# EAGLE design HuUSB_rev_B (EAGLE 9.6.2)
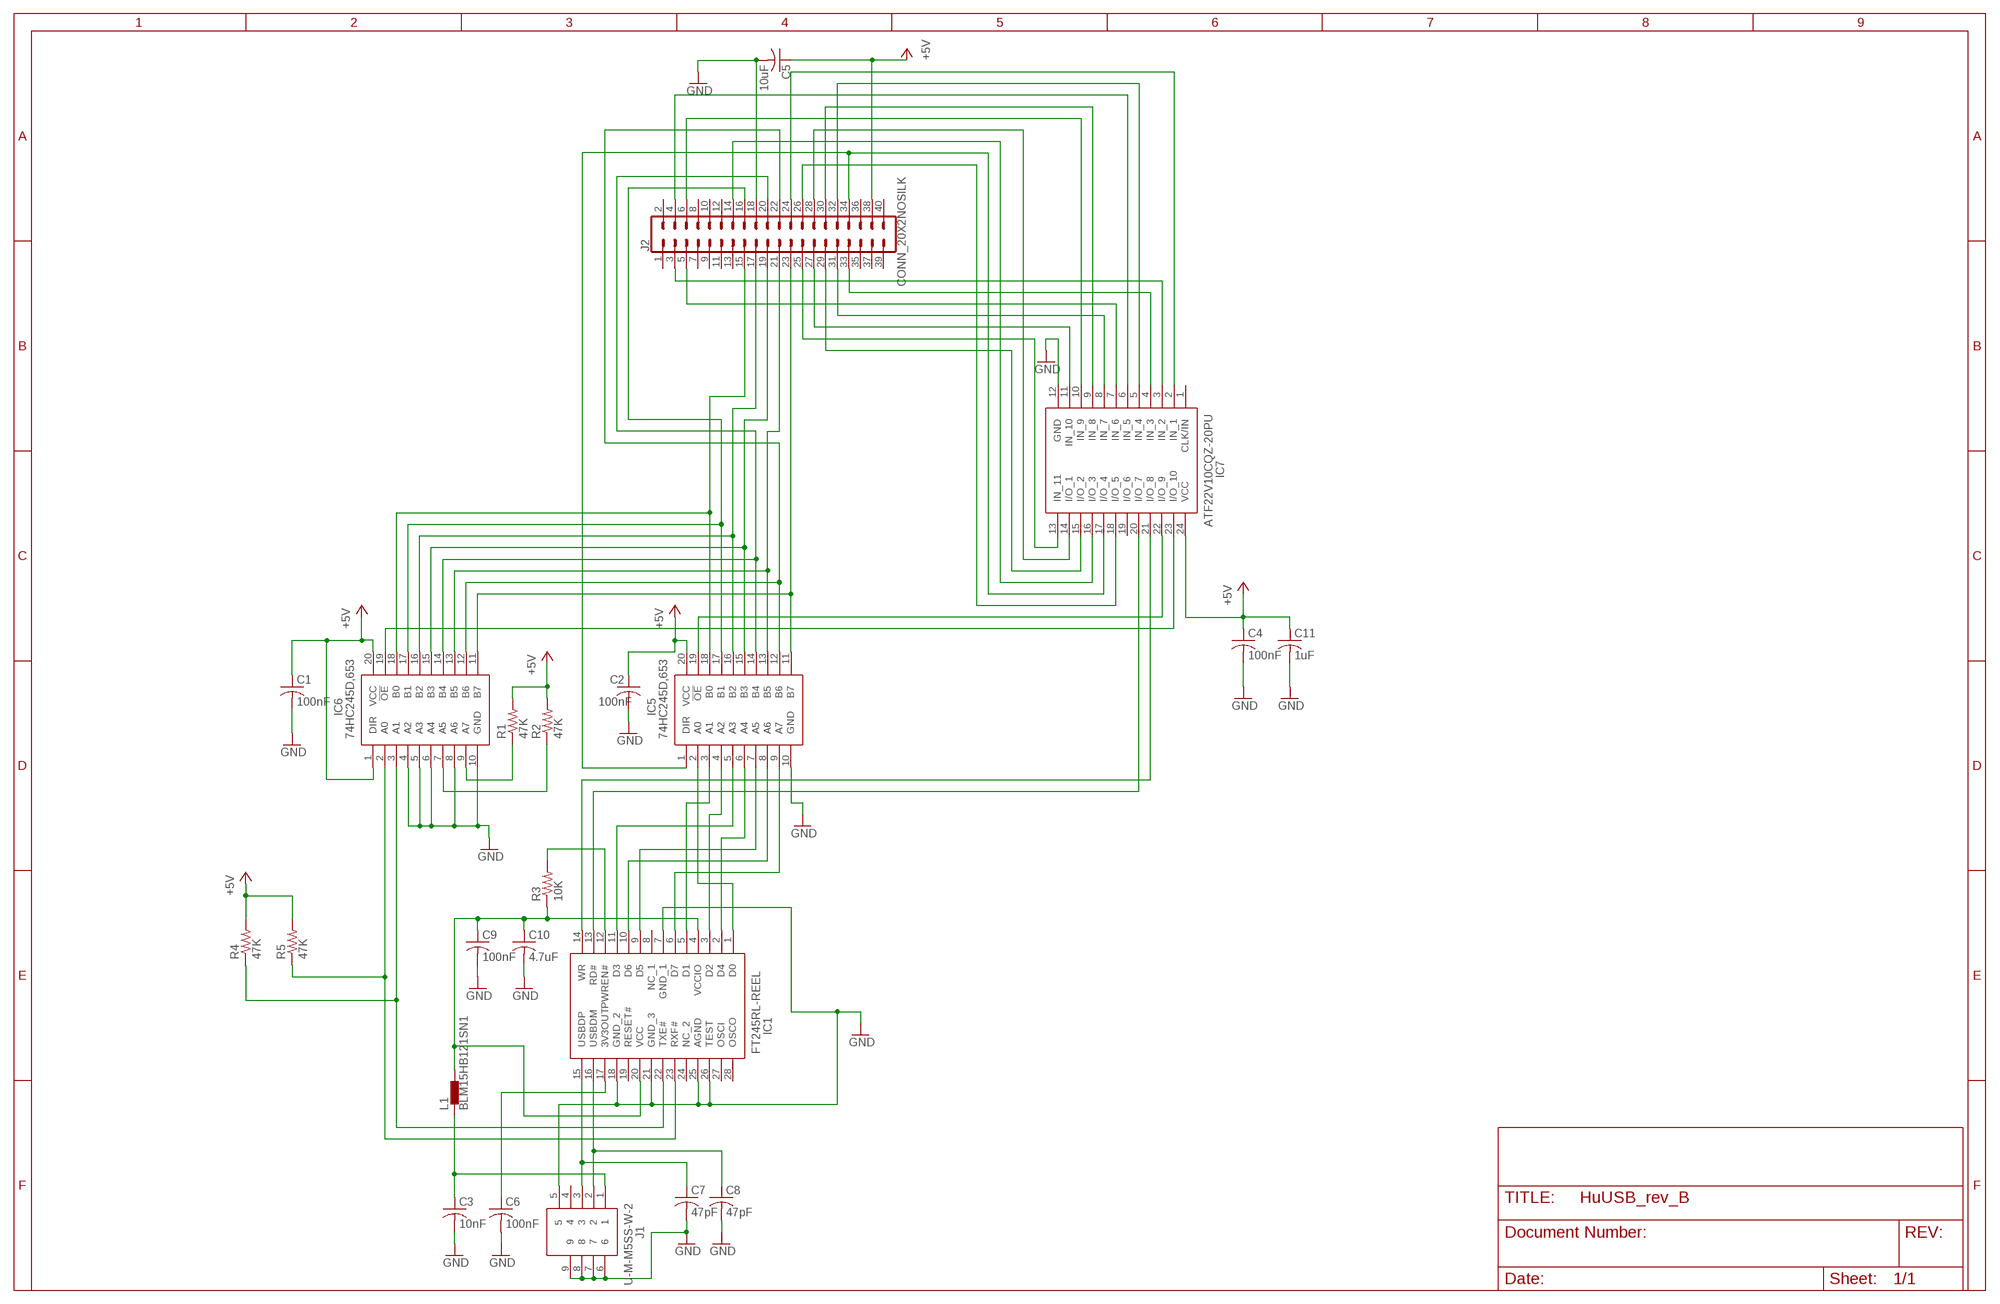
[diagram p0: schematic, sheet 1]

## Parts
C1  100nF  C-USC0603  [C0603]
C2  100nF  C-USC0603  [C0603]
C3  10nF  C-USC0603  [C0603]
C4  100nF  C-USC0603  [C0603]
C5  10uF  C-USC0805  [C0805]
C6  100nF  C-USC0603  [C0603]
C7  47pF  C-USC0603  [C0603]
C8  47pF  C-USC0603  [C0603]
C9  100nF  C-USC0603  [C0603]
C10  4.7uF  C-USC0603  [C0603]
C11  1uF  C-USC0603  [C0603]
IC1  FT245RL-REEL  [SOP65P778X200-28N]
IC5  74HC245D,653  [SOIC127P1032X265-20N]
IC6  74HC245D,653  [SOIC127P1032X265-20N]
IC7  ATF22V10CQZ-20PU  [DIP794W56P254L3188H533Q24N]
J1  U-M-M5SS-W-2  [U-M-M5SS-W-2]
J2  CONN_20X2NOSILK  [2X20_NOSILK]
L1  BLM15HB121SN1  [0402]
R1  47K  R-US_R0603  [R0603]
R2  47K  R-US_R0603  [R0603]
R3  10K  R-US_R0603  [R0603]
R4  47K  R-US_R0603  [R0603]
R5  47K  R-US_R0603  [R0603]

## Nets
+5V: C1.1 C2.1 C4.1 C5.1 C11.1 IC5.20(VCC) IC6.1(DIR) IC6.20(VCC) IC7.24(VCC) J2.38 R1.2 R2.2 R4.2 R5.2
GND: C1.2 C2.2 C3.2 C4.2 C5.2 C6.2 C7.2 C8.2 C9.2 C10.2 C11.2 IC1.7(GND_1) IC1.18(GND_2) IC1.21(GND_3) IC1.25(AGND) IC1.26(TEST) IC5.10(GND) IC6.4(A2) IC6.5(A3) IC6.6(A4) IC6.8(A6) IC6.10(GND) IC7.12(GND) J1.5 J1.6 J1.7 J1.8 J1.9 J2.18
N$1: IC7.2(IN_1) J2.24
N$2: IC7.3(IN_2) J2.3
N$3: IC7.4(IN_3) J2.33
N$4: IC7.5(IN_4) J2.32
N$5: IC7.6(IN_5) J2.4
N$6: IC7.7(IN_6) J2.5
N$7: IC7.8(IN_7) J2.31
N$8: IC7.9(IN_8) J2.30
N$9: IC7.10(IN_9) J2.6
N$10: IC7.11(IN_10) J2.27
N$11: IC7.13(IN_11) J2.25
N$12: IC7.14(I/O_1) J2.28
N$13: IC7.15(I/O_2) J2.29
N$14: IC7.16(I/O_3) J2.14
N$15: IC5.1(DIR) IC7.17(I/O_4) J2.34
N$16: IC7.18(I/O_5) J2.26
N$17: IC1.14(WR) IC7.21(I/O_8)
N$18: IC1.1(D0) IC5.2(A0)
N$19: IC6.9(A7) R1.1
N$20: IC1.2(D4) IC5.6(A4)
N$21: IC1.11(D3) IC5.5(A3)
N$22: IC1.5(D1) IC5.3(A1)
N$23: IC1.9(D5) IC5.7(A5)
N$24: IC1.10(D6) IC5.8(A6)
N$25: IC1.6(D7) IC5.9(A7)
N$26: IC6.19(!OE) IC7.23(I/O_10)
N$27: IC5.19(!OE) IC7.22(I/O_9)
N$28: IC5.18(B0) IC6.18(B0) J2.15
N$29: IC1.13(RD#) IC7.20(I/O_7)
N$30: IC5.17(B1) IC6.17(B1) J2.16
N$31: IC5.16(B2) IC6.16(B2) J2.17
N$32: IC5.15(B3) IC6.15(B3) J2.19
N$33: IC5.14(B4) IC6.14(B4) J2.20
N$34: IC5.13(B5) IC6.13(B5) J2.21
N$35: IC5.12(B6) IC6.12(B6) J2.22
N$36: IC5.11(B7) IC6.11(B7) J2.23
N$37: IC1.3(D2) IC5.4(A2)
N$38: C6.1 IC1.17(3V3OUT)
N$39: IC6.7(A5) R2.1
N$40: C7.1 IC1.15(USBDP) J1.3
N$41: C8.1 IC1.16(USBDM) J1.2
N$42: C9.1 C10.1 IC1.4(VCCIO) IC1.20(VCC) L1.2 R3.1
N$43: IC1.12(PWREN#) R3.2
N$44: C3.1 J1.1 L1.1
N$45: IC1.22(TXE#) IC6.3(A1) R4.1
N$46: IC1.23(RXF#) IC6.2(A0) R5.1
Unconnected: IC1.8(NC_1) IC1.19(RESET#) IC1.24(NC_2) IC1.27(OSCI) IC1.28(OSCO) IC7.1(CLK/IN) IC7.19(I/O_6) J1.4 J2.1 J2.2 J2.7 J2.8 J2.9 J2.10 J2.11 J2.12 J2.13 J2.35 J2.36 J2.37 J2.39 J2.40

## Library data of the parts
C1-C11 = resistor:C-US: CAPACITOR, American symbol
IC1 = PC-Engine:FT245RL-REEL: FTDI Chip FT245RL-REEL, USB Controller, 1Mbps, USB 2.0, 1.8 5.25 V, 28-Pin SSOP Source: Datasheet <https://www.ftdichip.com/Support/Documents/DataSheets/ICs/DS_FT245R.pdf>; ARROW_PART_NUMBER: FT245RL-REEL; ARROW_PRICE-STOCK: https://www.arrow.com/en/products/ft245rl-reel/ftdi-chip; DESCRIPTION: FTDI Chip FT245RL-REEL, USB Controller, 1Mbps, USB 2.0, 1.8 5.25 V, 28-Pin SSOP; HEIGHT: 2mm; MANUFACTURER_NAME: FTDI Chip; MANUFACTURER_PART_NUMBER: FT245RL-REEL; MOUSER_PART_NUMBER: 895-FT245RL; MOUSER_PRICE-STOCK: https://www.mouser.co.uk/ProductDetail/FTDI/FT245RL-REEL?qs=D1%2FPMqvA1020O4Xjb5coqA%3D%3D
IC5 IC6 = PC-Engine:74HC245D,653: 74HC(T)245 - Octal bus transceiver; 3-state@en-us Source: Datasheet <https://assets.nexperia.com/documents/data-sheet/74HC_HCT245.pdf>; ARROW_PART_NUMBER: 74HC245D,653; ARROW_PRICE-STOCK: https://www.arrow.com/en/products/74hc245d653/nexperia; DESCRIPTION: 74HC(T)245 - Octal bus transceiver; 3-state@en-us; HEIGHT: 2.65mm; MANUFACTURER_NAME: Nexperia; MANUFACTURER_PART_NUMBER: 74HC245D,653; MOUSER_PART_NUMBER: 771-74HC245D-T; MOUSER_PRICE-STOCK: https://www.mouser.co.uk/ProductDetail/Nexperia/74HC245D653/?qs=P62ublwmbi8JbvNhK4vCnA%3D%3D
IC7 = PC-Engine:ATF22V10CQZ-20PU: SPLD 500 Gates 10 Macro Cells 50MHz 5V ATF22V10CQZ-20PU, SPLD PAL 500 Gates, 10 Macro Cells, 10 I/O, 45.5MHz 20ns EECMOS 4.5 5.5 V 24-Pin PDIP Source: Datasheet <http://uk.rs-online.com/web/p/products/7380319>; ARROW_PART_NUMBER: ATF22V10CQZ-20PU; ARROW_PRICE-STOCK: https://www.arrow.com/en/products/atf22v10cqz-20pu/microchip-technology; DESCRIPTION: SPLD 500 Gates 10 Macro Cells 50MHz 5V ATF22V10CQZ-20PU, SPLD PAL 500 Gates, 10 Macro Cells, 10 I/O, 45.5MHz 20ns EECMOS 4.5 5.5 V 24-Pin PDIP; HEIGHT: 5.334mm; MANUFACTURER_NAME: Microchip; MANUFACTURER_PART_NUMBER: ATF22V10CQZ-20PU; MOUSER_PART_NUMBER: 556-AF22V10CQZ-20PU; MOUSER_PRICE-STOCK: https://www.mouser.co.uk/ProductDetail/Microchip-Technology-Atmel/ATF22V10CQZ-20PU/?qs=2mdvTlUeTfCbTTksYbflfg%3D%3D
J1 = PC-Engine:U-M-M5SS-W-2
J2 = SparkFun-Connectors:CONN_20X2: Multi connection point. Often used as Generic Header-pin footprint for 0.1 inch spaced/style header connections On any of the 0.1 inch spaced packages, you can populate with these: Break Away Headers - Straight <https://www.sparkfun.com/products/116> (PRT-00116) Break Away Male Headers - Right Angle <https://www.sparkfun.com/products/553> (PRT-00553) Female Headers <https://www.sparkfun.com/products/115> (PRT-00115) Break Away Headers - Machine Pin <https://www.sparkfun.com/products/117> (PRT-00117) Break Away Female Headers - Swiss Machine Pin <https://www.sparkfun.com/products/743> (PRT-00743)
L1 = inductors:BLM15H: EMIFIL (R) Chip Ferrite Bead for GHz Noise Source: http://www.murata.com/ Ferrite Bead BLM15H.pdf
R1-R5 = resistor:R-US_: RESISTOR, American symbol

## Board
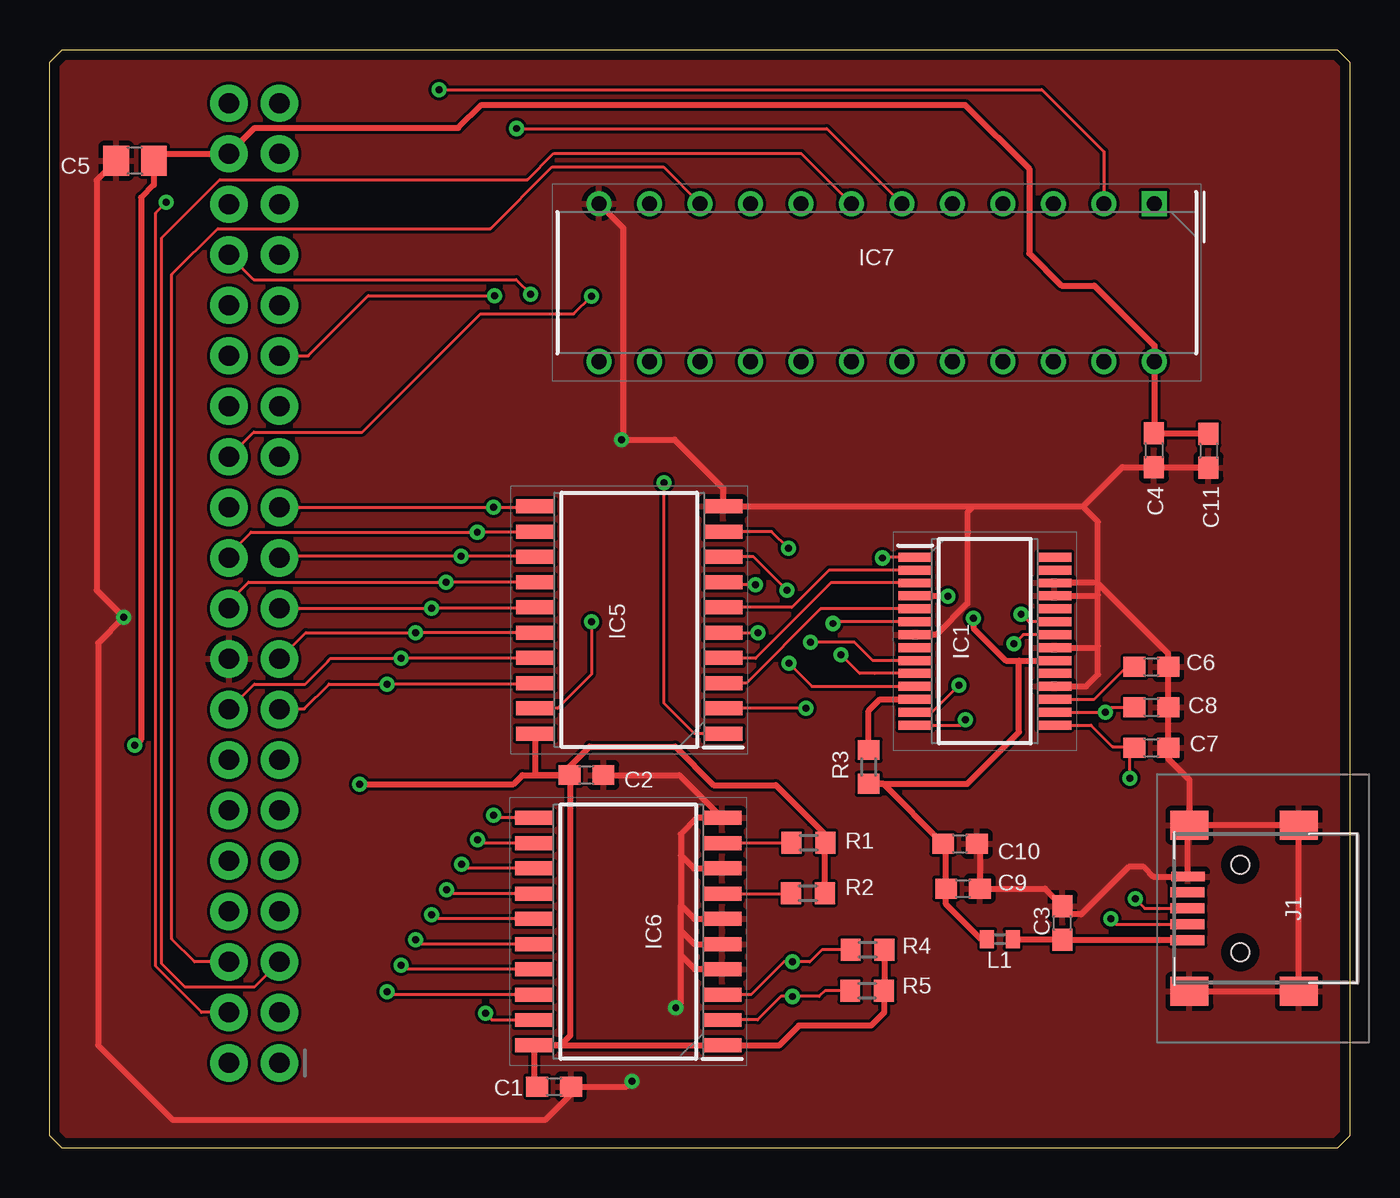
[diagram p1: board, top side]
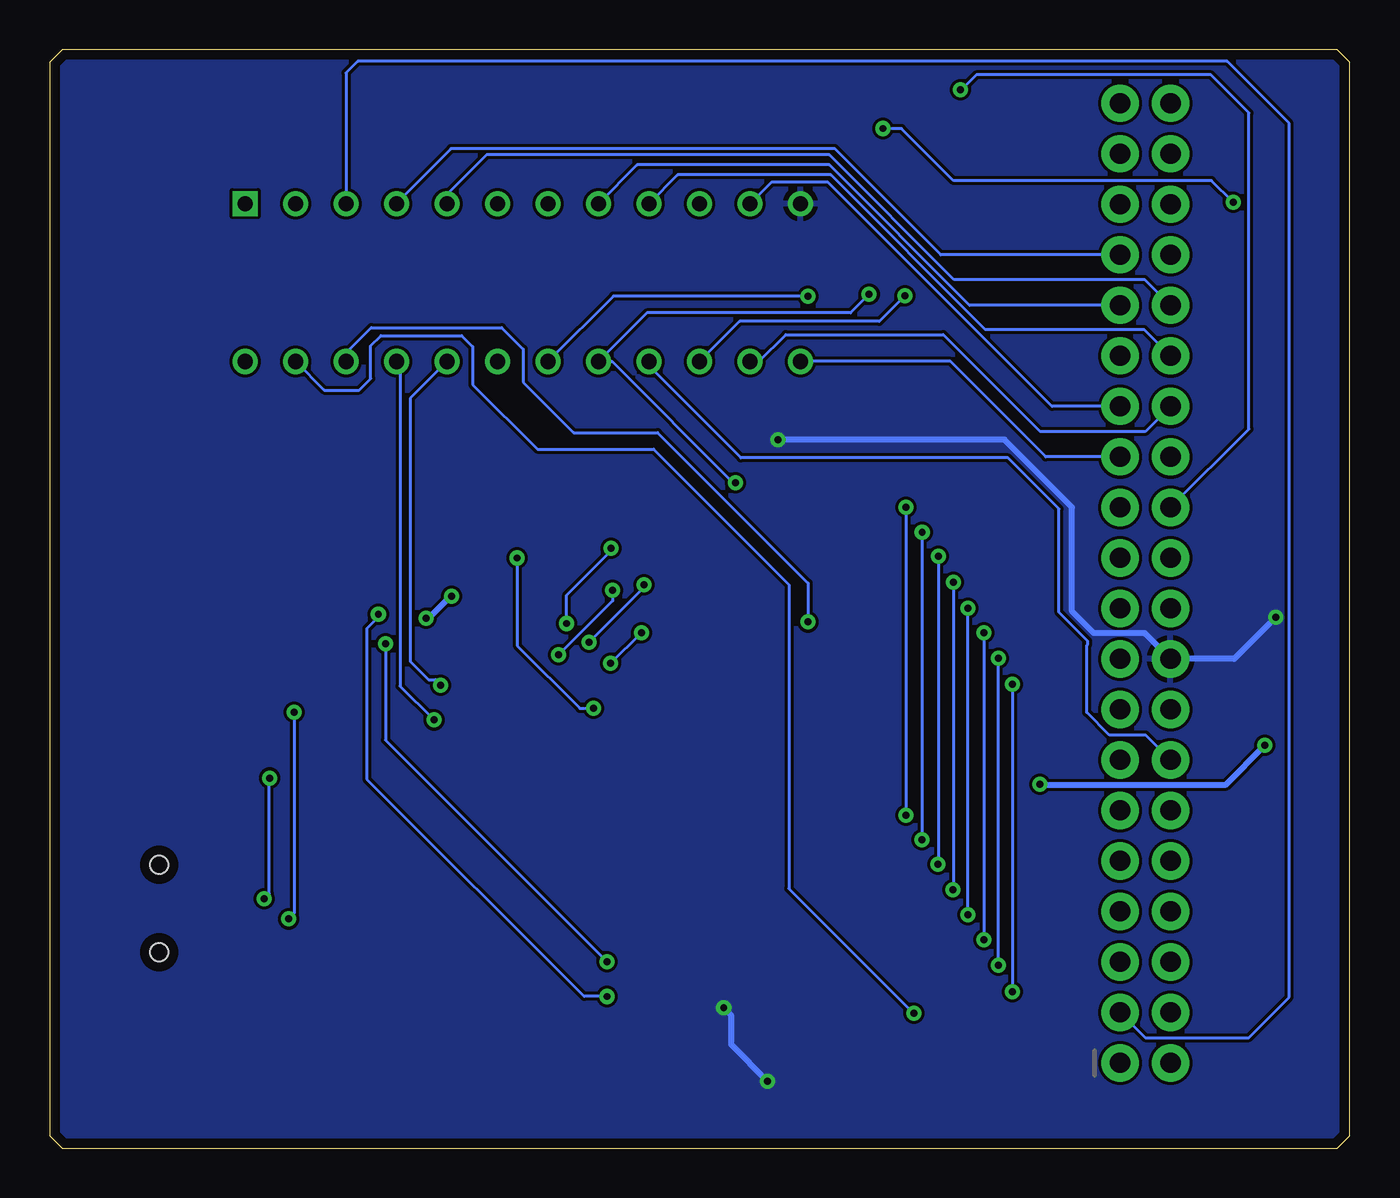
[diagram p2: board, bottom side, seen from below]

Size 65.41 x 55.24 mm. Coordinates in mm from the lower left corner, seen from the top.
Outline: 0.64,55.24 64.77,55.24 65.41,54.61 65.41,0.64 64.77,0 0.64,0 0,0.64 0,54.61 0.64,55.24
Copper layers (1*16): Top 0.035mm / dielectric 1.5mm / Bottom 0.035mm
Design rules "default *": minimum track width 6mil, minimum drill 0.35mm, track to track 6mil, track to pad 6mil, pad to pad 6mil, via to via 6mil, smd to smd 6mil, copper to edge 20mil, drill to drill 6mil, minimum pad ring 10mil, minimum via ring 8mil, stop-mask expansion 2mil, vias tented up to drill 15mil, thermal gap 10mil

### Footprints (pad centres in the part's own frame; a part is rotated, then mirrored left to right if it is on the bottom)
C0603 = smd 1.1 x 1: 1 -0.85,0; 2 0.85,0
C0805 = smd 1.3 x 1.5: 1 -0.95,0; 2 0.95,0
SOP65P778X200-28N = smd 1.7 x 0.45: 1 -3.5,4.225; 2 -3.5,3.575; 3 -3.5,2.925; 4 -3.5,2.275; 5 -3.5,1.625; 6 -3.5,0.975; 7 -3.5,0.325; 8 -3.5,-0.325; 9 -3.5,-0.975; 10 -3.5,-1.625; 11 -3.5,-2.275; 12 -3.5,-2.925; 13 -3.5,-3.575; 14 -3.5,-4.225; 15 3.5,-4.225; 16 3.5,-3.575; 17 3.5,-2.925; 18 3.5,-2.275; 19 3.5,-1.625; 20 3.5,-0.975; 21 3.5,-0.325; 22 3.5,0.325; 23 3.5,0.975; 24 3.5,1.625; 25 3.5,2.275; 26 3.5,2.925; 27 3.5,3.575; 28 3.5,4.225
SOIC127P1032X265-20N = smd 1.95 x 0.7: 1 -4.725,5.715; 2 -4.725,4.445; 3 -4.725,3.175; 4 -4.725,1.905; 5 -4.725,0.635; 6 -4.725,-0.635; 7 -4.725,-1.905; 8 -4.725,-3.175; 9 -4.725,-4.445; 10 -4.725,-5.715; 11 4.725,-5.715; 12 4.725,-4.445; 13 4.725,-3.175; 14 4.725,-1.905; 15 4.725,-0.635; 16 4.725,0.635; 17 4.725,1.905; 18 4.725,3.175; 19 4.725,4.445; 20 4.725,5.715
DIP794W56P254L3188H533Q24N = drill 0.759 pad 1.159 square: 1 -3.969,13.97 | drill 0.759 pad 1.159: 2 -3.969,11.43; 3 -3.969,8.89; 4 -3.969,6.35; 5 -3.969,3.81; 6 -3.969,1.27; 7 -3.969,-1.27; 8 -3.969,-3.81; 9 -3.969,-6.35; 10 -3.969,-8.89; 11 -3.969,-11.43; 12 -3.969,-13.97; 13 3.969,-13.97; 14 3.969,-11.43; 15 3.969,-8.89; 16 3.969,-6.35; 17 3.969,-3.81; 18 3.969,-1.27; 19 3.969,1.27; 20 3.969,3.81; 21 3.969,6.35; 22 3.969,8.89; 23 3.969,11.43; 24 3.969,13.97
U-M-M5SS-W-2 = smd 0.5 x 1.7: 1 -1.6,3.798; 2 -0.8,3.798; 3 0,3.798; 4 0.8,3.798; 5 1.6,3.772 | smd 1.45 x 1.9: 6 -4.175,3.698; 7 -4.175,-1.802; 8 4.175,3.698; 9 4.175,-1.802 | hole 0.9: -2.2,1.148; 2.2,1.148
2X20_NOSILK = drill 1.016 pad 1.88: 1 0,0; 2 0,2.54; 3 2.54,0; 4 2.54,2.54; 5 5.08,0; 6 5.08,2.54; 7 7.62,0; 8 7.62,2.54; 9 10.16,0; 10 10.16,2.54; 11 12.7,0; 12 12.7,2.54; 13 15.24,0; 14 15.24,2.54; 15 17.78,0; 16 17.78,2.54; 17 20.32,0; 18 20.32,2.54; 19 22.86,0; 20 22.86,2.54; 21 25.4,0; 22 25.4,2.54; 23 27.94,0; 24 27.94,2.54; 25 30.48,0; 26 30.48,2.54; 27 33.02,0; 28 33.02,2.54; 29 35.56,0; 30 35.56,2.54; 31 38.1,0; 32 38.1,2.54; 33 40.64,0; 34 40.64,2.54; 35 43.18,0; 36 43.18,2.54; 37 45.72,0; 38 45.72,2.54; 39 48.26,0; 40 48.26,2.54
0402 = smd 0.7 x 0.9: 1 -0.65,0; 2 0.65,0
R0603 = smd 1 x 1.1: 1 -0.85,0; 2 0.85,0

### Placement (x,y rotation side)
C1  25.37,3.1 0 top
C2  27,18.77 0 top
C3  50.95,11.33 90 top
C4  55.55,35.1 270 top
C5  4.29,49.66 180 top
C6  55.42,24.21 0 top
C7  55.42,20.14 0 top
C8  55.42,22.17 0 top
C9  45.95,13.06 0 top
C10  45.8,15.32 0 top
C11  58.29,35.08 270 top
IC1  47.04,25.5 0 top
IC5  29.16,26.57 180 top
IC6  29.11,10.9 180 top
IC7  41.61,43.54 270 top
J1  61.04,12.06 90 top
J2  11.56,4.29 90 top
L1  47.8,10.52 180 top
R1  38.18,15.37 0 top
R2  38.15,12.83 0 top
R3  41.2,19.18 90 top
R4  41.15,9.98 0 top
R5  41.12,7.92 0 top

### Tracks (layer width: path | path; a pad name or v marks a point on that pad's centre or on a via)
+5V  (via drill 0.35)
  Top 0.305: v4.27,20.27 4.32,20.27 4.6,20.55 4.6,47.8 5.24,48.45 C5.1 5.6,50.01 J2.38 10.31,51.31 20.55,51.31 21.72,52.48 46.05,52.48 49.28,49.25 49.28,45.01 50.9,43.38 52.55,43.38 55.58,40.36 IC7.24 55.58,35.98 | v15.6,18.31 23.33,18.31 23.79,18.77 C2.1 | C2.1 24.43,18.77 IC5.20 | C2.1 26.19,18.73 26.19,5.66 25.7,5.18 IC6.20 | C1.1 24.38,3.24 IC6.20 | IC6.20 IC6.1 33.86,5.16 36.68,5.16 37.69,6.17 41.33,6.17 41.97,6.82 R5.2 42,7.95 R4.2 | C2.1 26.15,19.19 27.15,20.19 31.47,20.19 33.4,18.26 36.52,18.26 39.03,15.76 R1.2 39,15.34 R2.2 | 55.58,35.98 C4.1 | C11.1 55.63,35.93 55.58,35.98
  Bottom 0.305: v4.27,20.27 6.27,18.26 15.54,18.26 v15.6,18.31
GND  (via drill 0.35)
  Top 0.305: IC7.12 28.85,46.28 28.85,35.71 v28.78,35.64 31.45,35.64 33.88,33.2 IC5.10 46.43,32.28 46.46,32.26 | C5.2 2.36,48.68 2.36,28.07 v3.73,26.7 2.44,25.4 2.44,5.18 6.2,1.42 24.94,1.42 26.23,2.7 C1.2 29.01,3.1 v29.29,3.38 | C2.2 31.67,18.77 IC6.10 32.56,16.61 31.75,15.8 31.75,14.73 | IC6.8 32.41,14.07 31.75,14.73 | 31.75,14.73 31.75,12.22 | IC6.6 32.44,11.53 31.75,12.22 | IC6.4 32.46,8.99 31.75,9.7 | 31.75,9.7 31.75,10.95 | 31.75,10.95 31.75,12.22 | 31.75,10.95 32.44,10.26 IC6.5 | v31.5,7.06 31.75,7.32 31.75,9.7 | IC1.18 52.13,23.23 52.73,23.82 52.73,25.25 | 52.73,25.25 52.73,27.81 | 52.73,27.81 52.73,28.42 | 52.73,28.42 52.73,28.43 IC1.26 | IC1.25 52.69,27.78 52.73,27.81 | IC1.21 52.66,25.18 52.73,25.25 | 52.73,28.42 52.73,31.5 51.97,32.26 | 51.97,32.26 46.46,32.26 | 46.46,32.26 46.18,31.98 46.18,27.41 44.6,25.83 IC1.7 | 51.97,32.26 53.96,34.25 C4.2 58.27,34.25 C11.2 | 52.73,28.42 56.27,24.88 C6.2 C8.2 C7.2 56.27,19.6 57.34,18.53 J1.8 | C10.2 46.8,15.16 C9.2 50.08,13.06 C3.2 51.37,11.76 51.89,11.76 54.28,14.15 55.04,14.15 55.52,13.66 J1.5 57.26,16.16 J1.8 | J1.6 J1.7 J1.9 J1.8
  Bottom 0.305: v28.78,35.64 17.37,35.64 13.97,32.23 13.97,27 12.88,25.91 10.31,25.91 J2.18 5.82,24.61 v3.73,26.7 | v29.29,3.38 31.11,5.21 31.11,6.68 v31.5,7.06
  pour Top: -1.27,-1.27 -1.27,55.88 66.04,55.88 66.04,-1.27
  pour Bottom: -1.27,-1.27 -1.27,55.88 66.04,55.88 66.04,-1.27
N$1  (via drill 0.35)
  Top 0.152: v19.58,53.24 49.91,53.24 53.03,50.11 IC7.2
  Bottom 0.152: J2.24 5.08,36.17 5.08,52.07 6.99,53.98 18.8,53.98 19.53,53.24 v19.58,53.24
N$2
  Bottom 0.152: J2.3 10.29,5.56 5.08,5.56 3.05,7.59 3.05,51.54 6.17,54.66 49.91,54.66 50.49,54.08 IC7.3
N$3
  Bottom 0.152: J2.33 20.57,44.93 25.91,50.27 45.21,50.27 47.95,47.52 IC7.4
N$4
  Bottom 0.152: J2.32 10.31,43.69 19.91,43.69 26.19,49.96 43.43,49.96 45.41,47.98 IC7.5
N$5  (via drill 0.35)
  Top 0.152: J2.4 7.64,6.83 5.33,9.14 5.33,47.04 v5.87,47.57 | IC7.6 39.1,51.28 v23.5,51.28
  Bottom 0.152: v5.87,47.57 6.96,48.67 19.94,48.67 22.55,51.28 v23.5,51.28
N$6
  Top 0.152: J2.5 10.29,8.1 6.81,8.1 5.64,9.27 5.64,45.8 8.56,48.72 24.03,48.72 25.35,50.04 37.8,50.04 IC7.7
N$7
  Bottom 0.152: J2.31 19.13,42.39 26.19,49.45 35.85,49.45 IC7.8
N$8
  Bottom 0.152: J2.30 10.34,41.17 18.34,41.17 26.11,48.95 33.81,48.95 IC7.9
N$9
  Top 0.152: J2.6 7.29,9.37 6.15,10.52 6.15,43.94 8.46,46.25 22.17,46.25 25.27,49.35 30.87,49.35 IC7.10
N$10
  Bottom 0.152: J2.27 14.99,37.31 26.26,48.59 29.09,48.59 IC7.11
N$11
  Bottom 0.152: J2.25 15.29,34.77 20.09,39.57 IC7.13
N$12
  Bottom 0.152: J2.28 10.29,36.04 15.58,36.04 20.45,40.91 28.37,40.91 29.72,39.57 IC7.14
N$13  (via drill 0.35)
  Top 0.152: J2.29 13.01,39.85 16.03,42.88 v22.38,42.88
  Bottom 0.152: v22.38,42.88 23.67,41.58 30.7,41.58 IC7.15
N$14
  Bottom 0.152: J2.14 10.26,20.78 12.09,20.78 13.23,21.92 13.23,25.27 13.18,25.32 13.18,25.5 14.63,26.95 14.63,32.16 17.2,34.72 30.63,34.72 35.26,39.34 IC7.16
N$15  (via drill 0.35)
  Top 0.152: J2.34 10.26,43.69 23.47,43.69 24.18,42.98 v24.18,42.95 | IC5.1 32.44,20.85 30.91,22.38 v30.91,33.48
  Bottom 0.152: v24.18,42.95 25.12,42.01 35.36,42.01 IC7.17 37.11,39.57 31.02,33.48 v30.91,33.48
N$16  (via drill 0.35)
  Top 0.152: J2.26 10.26,36.02 15.72,36.02 21.67,41.96 26.36,41.96 v27.25,42.85
  Bottom 0.152: v27.25,42.85 37.05,42.85 IC7.18
N$17  (via drill 0.35)
  Top 0.152: IC1.14 45.84,21.28 46.08,21.51 v46.08,21.54
  Bottom 0.152: v46.08,21.54 47.78,23.24 47.78,39.39 IC7.21
N$18  (via drill 0.35)
  Top 0.152: IC1.1 43.53,29.72 41.92,29.72 v41.88,29.68 | v38.05,22.12 IC5.2
  Bottom 0.152: v41.88,29.68 41.88,25.27 38.73,22.12 v38.05,22.12
N$19
  Top 0.152: IC6.9 33.86,15.37 R1.1
N$20
  Top 0.152: IC1.2 39.21,29.08 37.34,27.2 IC5.6
N$21  (via drill 0.35)
  Top 0.152: IC5.5 v35.64,25.93 | v37.19,24.38 38.34,23.23 IC1.11
  Bottom 0.152: v37.19,24.38 v35.64,25.93
N$22
  Top 0.152: IC1.5 38.78,27.13 35.05,23.39 IC5.3
N$23  (via drill 0.35)
  Top 0.152: IC1.9 41.41,24.53 40.48,25.45 v38.28,25.45 | v35.51,28.35 34.01,28.35 IC5.7
  Bottom 0.152: v38.28,25.45 35.53,28.19 35.53,28.35 v35.51,28.35
N$24  (via drill 0.35)
  Top 0.152: IC1.10 41.5,23.88 40.74,23.88 v39.8,24.82 | v37.08,28.07 35.41,29.74 IC5.8
  Bottom 0.152: v39.8,24.82 37.08,27.53 v37.08,28.07
N$25  (via drill 0.35)
  Top 0.152: IC1.6 39.48,26.48 v39.4,26.39 | v37.16,30.18 36.32,31.01 IC5.9
  Bottom 0.152: v37.16,30.18 37.16,30.05 39.4,27.81 v39.4,26.39
N$26  (via drill 0.35)
  Top 0.152: v21.92,6.78 22.25,6.45 IC6.19
  Bottom 0.152: IC7.23 51.59,38.12 49.84,38.12 49.25,38.71 49.25,40.36 48.74,40.87 44.68,40.87 44.12,40.31 44.12,38.41 40.87,35.15 35.03,35.15 28.22,28.35 28.22,13.06 21.95,6.78 v21.92,6.78
N$27  (via drill 0.35)
  Top 0.152: v27.25,26.47 27.25,23.82 25.55,22.12 IC5.19
  Bottom 0.152: IC7.22 50.49,40.01 49.23,41.27 42.67,41.27 41.58,40.18 41.58,38.53 39.04,35.99 34.82,35.99 27.25,28.42 v27.25,26.47
N$28  (via drill 0.35)
  Top 0.152: J2.15 11.58,22.1 12.8,22.1 14.05,23.34 v16.97,23.34 24.38,23.34 IC5.18 | v16.97,7.87 17.12,7.72 IC6.18
  Bottom 0.152: v16.97,23.34 v16.97,7.87
N$29  (via drill 0.35)
  Top 0.152: v45.74,23.29 44.38,21.93 IC1.13
  Bottom 0.152: IC7.20 47.27,37.71 47.27,24.49 46.35,23.57 46,23.57 45.74,23.32 v45.74,23.29
N$30  (via drill 0.35)
  Top 0.152: J2.16 10.29,23.34 12.85,23.34 13.99,24.49 13.99,24.51 14.12,24.64 v17.68,24.64 24.41,24.64 IC5.17 | v17.68,9.2 17.88,8.99 IC6.17
  Bottom 0.152: v17.68,9.2 v17.68,24.64
N$31  (via drill 0.35)
  Top 0.152: IC5.16 v18.41,25.93 12.88,25.93 J2.17 | v18.41,10.49 18.64,10.26 IC6.16
  Bottom 0.152: v18.41,25.93 v18.41,10.49
N$32  (via drill 0.35)
  Top 0.152: IC5.15 24.38,27.15 v19.2,27.15 J2.19 | v19.2,11.73 19.41,11.53 IC6.15
  Bottom 0.152: v19.2,11.73 v19.2,27.15
N$33  (via drill 0.35)
  Top 0.152: IC5.14 v19.94,28.47 10.01,28.47 9.02,27.48 J2.20 | v19.96,13.01 20.17,12.8 IC6.14
  Bottom 0.152: v19.96,13.01 19.94,13.03 v19.94,28.47
N$34  (via drill 0.35)
  Top 0.152: J2.21 11.63,29.77 v20.7,29.77 24.41,29.77 IC5.13 | v20.71,14.29 20.93,14.07 IC6.13
  Bottom 0.152: v20.7,29.77 20.7,14.28 v20.71,14.29
N$35  (via drill 0.35)
  Top 0.152: IC5.12 24.41,30.99 v21.51,30.99 10.13,30.99 9.02,29.87 J2.22 | v21.53,15.51 21.69,15.34 IC6.12
  Bottom 0.152: v21.51,30.99 21.51,15.49 v21.53,15.51
N$36  (via drill 0.35)
  Top 0.152: IC5.11 24.38,32.23 v22.33,32.23 J2.23 | v22.33,16.74 22.33,16.66 22.38,16.61 IC6.11
  Bottom 0.152: v22.33,32.23 v22.33,16.74
N$37
  Top 0.152: IC1.3 39.3,28.43 35.51,24.64 33.91,24.64 IC5.4
N$38
  Top 0.152: IC1.17 52.55,22.58 54.18,24.21 C6.1
N$39
  Top 0.152: IC6.7 37.27,12.8 R2.1
N$40  (via drill 0.35)
  Top 0.152: IC1.15 52.38,21.28 53.47,20.19 54.56,20.19 54.51,20.14 | 54.51,20.14 C7.1 | v54.33,18.62 54.33,19.96 54.51,20.14 | v54.61,12.55 55.09,12.06 J1.3
  Bottom 0.152: v54.61,12.55 54.36,12.8 54.36,18.59 v54.33,18.62
N$41  (via drill 0.35)
  Top 0.152: IC1.16 v53.11,21.93 53.16,21.93 53.4,22.17 C8.1 | v53.39,11.53 53.66,11.27 J1.2
  Bottom 0.152: v53.39,11.53 53.09,11.84 53.09,21.9 v53.11,21.93
N$42  (via drill 0.35)
  Top 0.305: IC1.4 44.61,27.78 44.63,27.76 v45.19,27.76 | v46.48,26.64 46.48,26.16 48.12,24.53 48.77,24.53 | 48.77,24.53 IC1.20 | L1.2 46.85,10.52 45.1,12.27 C9.1 45.1,15.16 C10.1 41.94,18.33 R3.1 46.16,18.33 48.77,20.93 48.77,24.53
  Bottom 0.305: v45.19,27.76 45.24,27.76 46.35,26.64 v46.48,26.64
N$43
  Top 0.305: R3.2 41.2,22 41.78,22.58 IC1.12
N$44
  Top 0.305: J1.1 57.23,10.48 C3.1 48.49,10.48 L1.1
N$45  (via drill 0.35)
  Top 0.152: v48.51,25.38 48.97,25.83 IC1.22 | IC6.3 35.28,7.72 36.93,9.37 v37.36,9.37 38.24,9.37 38.85,9.98 R4.1
  Bottom 0.152: v48.51,25.38 48.51,20.52 v37.36,9.37
N$46  (via drill 0.35)
  Top 0.152: IC1.23 49.31,26.48 49.28,26.44 v48.87,26.85 | IC6.2 35.61,6.45 36.79,7.63 v37.38,7.63 38.71,7.63 39,7.92 R5.1
  Bottom 0.152: v48.87,26.85 48.87,26.72 49.45,26.14 49.45,18.57 38.52,7.63 v37.38,7.63

### Text on the board
tValues: NC :40 | 39: NC | +5V :38 | 37: /IRQ2 | 35: HiSpeed | /Reset :36 | /WR :34 | 33: A18 | A17 :32 | 31: A14 | A13 :30 | 29: A8 | A9 :28 | 27: A11 | /OE :26 | 25: A10 | A20 :24 | 23: D7 | D6: 22 | 21: D5 | D4 :20 | 19: D3 | GND :18 | 17: D2 | D1 :16 | 15: D0 | A0 :14 | 13: A1 | A2 :12 | 11: A3 | A4 :10 | 9: A5 | A6 :8 | 7: A7 | A12 :6 | 5: A15 | A16 :4 | 3: A19 | Audio_In :2 | HuUSB, ver. B | 1: Card / Detect | (c) 2021, Dave Shadoff
bValues: JLCJLCJLCJLC